# Altium project ADVPCB.PrjPcb
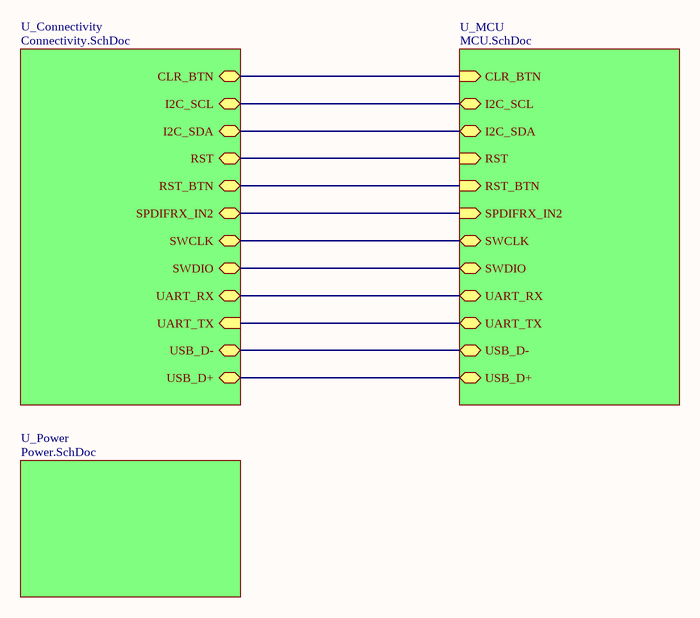
[diagram p0: Top.SchDoc]
4 sheets, 40 parts. Net scope: hierarchical (ports join the sheet entries above them; power ports are global).
Board file: Top.PcbDoc
Sheets:
  Top.SchDoc
    U_MCU = MCU.SchDoc
    U_Connectivity = Connectivity.SchDoc
    U_Power = Power.SchDoc

## Sheet Top.SchDoc
size A4; SheetNumber: 1; SheetTotal: 4

### Sub-sheets
U_Connectivity = Connectivity.SchDoc: SPDIFRX_IN2 (bidir), RST_BTN (bidir), CLR_BTN (bidir), I2C_SDA (bidir), I2C_SCL (bidir), UART_RX (bidir), UART_TX (in), RST (bidir), SWCLK (bidir), SWDIO (bidir), USB_D- (bidir), USB_D+ (bidir)
U_MCU = MCU.SchDoc: RST_BTN (in), SPDIFRX_IN2 (in), CLR_BTN (in), SWCLK (bidir), SWDIO (bidir), I2C_SCL (bidir), I2C_SDA (bidir), UART_TX (bidir), UART_RX (bidir), USB_D- (bidir), USB_D+ (bidir), RST (in)
U_Power = Power.SchDoc: no entries

### Nets
USBD_N: sheet U_MCU/USB_D-, sheet U_Connectivity/USB_D-
USBD_P: sheet U_MCU/USB_D+, sheet U_Connectivity/USB_D+
NetC12_2: sheet U_MCU/RST_BTN, sheet U_MCU/RST, sheet U_Connectivity/RST_BTN, sheet U_Connectivity/RST
NetC13_2: sheet U_MCU/CLR_BTN, sheet U_Connectivity/CLR_BTN
NetMCU_24: sheet U_MCU/SPDIFRX_IN2, sheet U_Connectivity/SPDIFRX_IN2
NetMCU_37: sheet U_MCU/UART_TX, sheet U_Connectivity/UART_TX
NetMCU_38: sheet U_MCU/UART_RX, sheet U_Connectivity/UART_RX
NetMCU_40: sheet U_MCU/I2C_SDA, sheet U_Connectivity/I2C_SDA
NetMCU_41: sheet U_MCU/I2C_SCL, sheet U_Connectivity/I2C_SCL
NetMCU_46: sheet U_MCU/SWDIO, sheet U_Connectivity/SWDIO
NetMCU_49: sheet U_MCU/SWCLK, sheet U_Connectivity/SWCLK

## Sheet MCU.SchDoc
size A4; SheetNumber: 2; SheetTotal: 4; SPICEModelCacheKZCSYQUI: <root> / <DocumentId>KZCSYQUI</DocumentId> / </root>
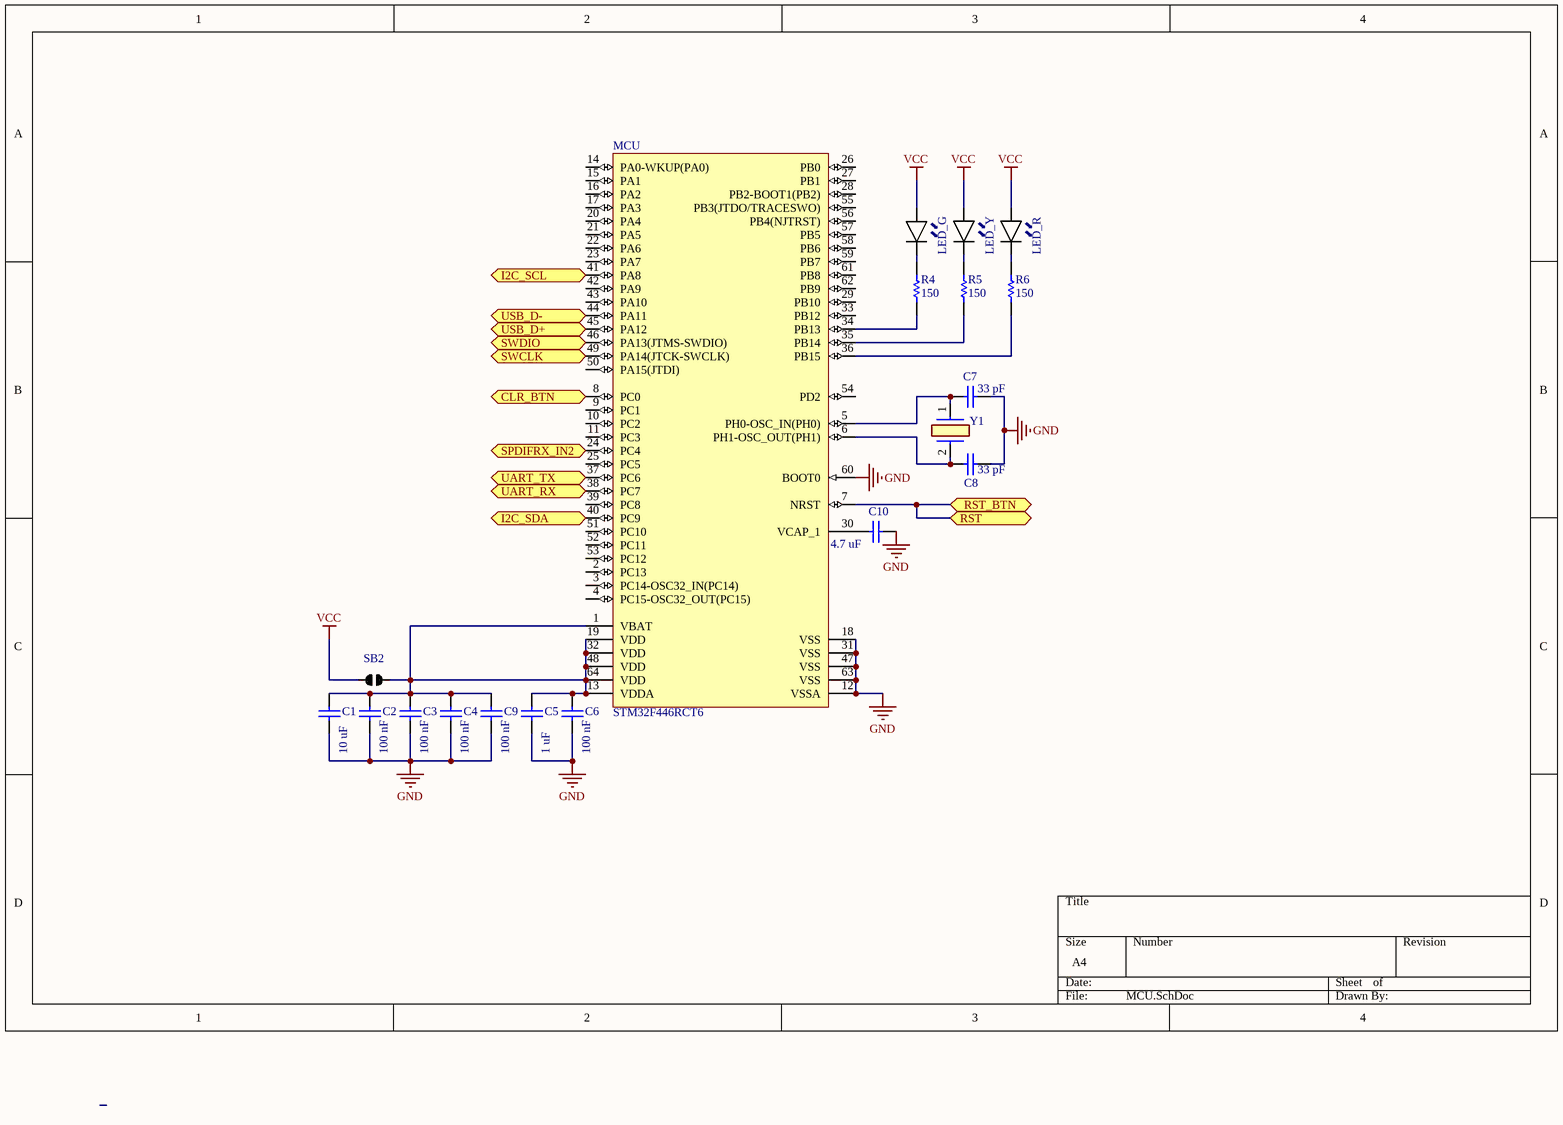
[diagram p1: MCU.SchDoc]

### Parts
C1  value 10 uF  [J1-0603]  (hidden comment: C19702)
C2  value 100 nF  [0402]  (hidden comment: C1525)
C3  value 100 nF  [0402]  (hidden comment: C1525)
C4  value 100 nF  [0402]  (hidden comment: C1525)
C5  value 1 uF  [J1-0603]  (hidden comment: C15849)
C6  value 100 nF  [0402]  (hidden comment: C1525)
C7  value 33 pF  [0402]  (hidden comment: C1562)
C8  value 33 pF  [0402]  (hidden comment: C1562)
C9  value 100 nF  [0402]  (hidden comment: C1525)
C10  value 4.7 uF  [J1-0603]  (hidden comment: C19666)
LED_G  fucking led maat hoe moeilijk ist kutprogram  [LED_SSL-LX4673GD-LA20]  (value not drawn)
LED_R  fucking led maat hoe moeilijk ist kutprogram  [LED_SSL-LX4673GD-LA20]  (value not drawn)
LED_Y  fucking led maat hoe moeilijk ist kutprogram  [LED_SSL-LX4673GD-LA20]  (value not drawn)
MCU  STM32F446RCT6  [STM-LQFP64_L]
R4  value 150  [J1-0603]  (hidden comment: C22808)
R5  value 150  [J1-0603]  (hidden comment: C22808)
R6  value 150  [J1-0603]  (hidden comment: C22808)
SB2  Solder Bridge  [Solder Bridge]  (value not drawn)
Y1  X50328MSB2GI  [RESC5032X135N]  (value not drawn)

### Ports
CLR_BTN (bidir, see Top[3A], Connectivity[3B]), I2C_SCL (bidir, see Top[3A], Connectivity[3C]), I2C_SDA (bidir, see Top[3A], Connectivity[3C]), RST (bidir, see Top[3B], Connectivity[3C]), RST_BTN (bidir, see Top[3B], Connectivity[2B]), SPDIFRX_IN2 (bidir, see Top[3B], Connectivity[3A]), SWCLK (bidir, see Top[3B], Connectivity[3C]), SWDIO (bidir, see Top[3B], Connectivity[3C]), UART_RX (bidir, see Top[3B], Connectivity[3C]), UART_TX (bidir, see Top[3B], Connectivity[3C]), USB_D+ (bidir, see Top[3B], Connectivity[2C]), USB_D- (bidir, see Top[3B], Connectivity[2C])

### Nets
GND: C1.1 C2.1 C3.1 C4.1 C5.1 C6.1 C7.2 C8.2 C9.1 C10.2 MCU.12(VSSA) MCU.18(VSS) MCU.31(VSS) MCU.47(VSS) MCU.60(BOOT0) MCU.63(VSS)
VCC: LED_G.2 LED_R.2 LED_Y.2 SB2.1
USBD_N: MCU.44(PA11) ; port USB_D-
USBD_P: MCU.45(PA12) ; port USB_D+
NetC1_2: C1.2 C2.2 C3.2 C4.2 C5.2 C6.2 C9.2 MCU.1(VBAT) MCU.13(VDDA) MCU.19(VDD) MCU.32(VDD) MCU.48(VDD) MCU.64(VDD) SB2.2
NetC7_1: C7.1 MCU.5(PH0-OSC_IN(PH0)) Y1.1
NetC8_1: C8.1 MCU.6(PH1-OSC_OUT(PH1)) Y1.2
NetC10_1: C10.1 MCU.30(VCAP_1)
NetC12_2: MCU.7(NRST) ; port RST_BTN, port RST
NetC13_2: MCU.8(PC0) ; port CLR_BTN
NetLED_G_1: LED_G.1 R4.1
NetLED_R_1: LED_R.1 R6.1
NetLED_Y_1: LED_Y.1 R5.1
NetMCU_24: MCU.24(PC4) ; port SPDIFRX_IN2
NetMCU_34: MCU.34(PB13) R4.2
NetMCU_35: MCU.35(PB14) R5.2
NetMCU_36: MCU.36(PB15) R6.2
NetMCU_37: MCU.37(PC6) ; port UART_TX
NetMCU_38: MCU.38(PC7) ; port UART_RX
NetMCU_40: MCU.40(PC9) ; port I2C_SDA
NetMCU_41: MCU.41(PA8) ; port I2C_SCL
NetMCU_46: MCU.46(PA13(JTMS-SWDIO)) ; port SWDIO
NetMCU_49: MCU.49(PA14(JTCK-SWCLK)) ; port SWCLK

Not connected (* = marked no-connect by the designer): MCU 2(PC13) 3(PC14-OSC32_IN(PC14)) 4(PC15-OSC32_OUT(PC15)) 9(PC1) 10(PC2) 11(PC3) 14(PA0-WKUP(PA0)) 15(PA1) 16(PA2) 17(PA3) 20(PA4) 21(PA5) 22(PA6) 23(PA7) 25(PC5) 26(PB0) 27(PB1) 28(PB2-BOOT1(PB2)) 29(PB10) 33(PB12) 39(PC8) 42(PA9) 43(PA10) 50(PA15(JTDI)) 51(PC10) 52(PC11) 53(PC12) 54(PD2) 55(PB3(JTDO/TRACESWO)) 56(PB4(NJTRST)) 57(PB5) 58(PB6) 59(PB7) 61(PB8) 62(PB9)

### Notes on the sheet
- (in symbol fucking led maat hoe moeilijk ist kutprogram) ⬈⬈

### Library data of the parts
C1-C10 = Cap: Capacitor; Published: 8-Jun-2000; LatestRevisionDate: 17-Jul-2002; LatestRevisionNote: Re-released for DXP Platform.; PackageReference: RAD-0.3; Publisher: Altium Limited; PackageDescription: Radial Cap, Thru-Hole; 2 Leads; 0.3 in Pin Spacing
LED_G LED_R LED_Y = fucking led maat hoe moeilijk ist kutprogram: DNP
MCU = CMP-0243-00216-1: ARM Cortex-M4 32-bit MCU+FPU, 256 KB Flash, 128 KB Internal RAM, 50 I/Os, 64-Pin LQFP, -40 to 85 degC, Tray; Operating Frequency(F) (Processor speed) (MHz): 180; Internal RAM Size (kB): 128; I/Os (High Current): 50; FLASH Size (Prog) (kB): 256; D/A Converter: 2; Supply Voltage(Vcc) min (V): 1.7; Mounting Technology: Surface Mount; DatasheetVersion: Rev. 6; ComponentLink1URL: http://www.st.com/; Package Description: LQFP64; ComponentLink1Description: Manufacturer URL; Packing: Tray; ComponentLink2Description: Datasheet; Core: ARM Cortex-M4; Package Reference: 64-Pin Low-profile Quad Flat Package, Body 10 x 10 mm, Pitch 0.5 mm; ComponentLink2URL: http://www.st.com/st-web-ui/static/active/en/resource/technical/document/datasheet/DM00141306.pdf
R4-R6 = Res1: Published: 8-Jun-2000; LatestRevisionDate: 17-Jul-2002; LatestRevisionNote: Re-released for DXP Platform.; PackageReference: AXIAL-0.3; Publisher: Altium Limited; PackageDescription: Axial Device, Thru-Hole; 2 Leads; 0.3 in Pin Spacing
SB2 = Solder Bridge: DNP
Y1 = X50328MSB2GI: C115962; Manufacturer_Name: Yangxing Tech; Datasheet Link: https://datasheet.lcsc.com/szlcsc/1903061615_Yangxing-Tech-X50328MSB2GI_C115962.pdf; Height: 1.35mm; Manufacturer_Part_Number: X50328MSB2GI

## Sheet Connectivity.SchDoc
size A4; SheetNumber: 3; SheetTotal: 4
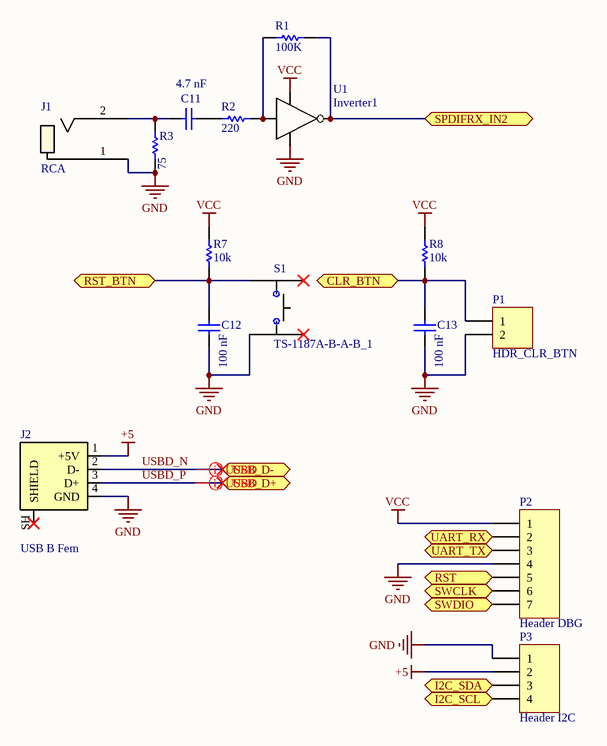
[diagram p2: Connectivity.SchDoc]

### Parts
C11  value 4.7 nF  [0402]  (hidden comment: C1538)
C12  value 100 nF  [0402]  (hidden comment: C1525)
C13  value 100 nF  [0402]  (hidden comment: C1525)
J1  RCA  [KLPX0848A2B]
J2  USB B Fem  [UJ2BH1TH]
P1  HDR_CLR_BTN  [HDR1X2]
P2  Header DBG  [HDR1X7]
P3  Header I2C  [HDR1X4]
R1  value 100K  [J1-0603]  (hidden comment: C25803)
R2  value 220  [J1-0603]  (hidden comment: C22962)
R3  value 75  [J1-0603]  (hidden comment: C4275)
R7  value 10k  [J1-0603]  (hidden comment: C25804)
R8  value 10k  [J1-0603]  (hidden comment: C25804)
S1  TS-1187A-B-A-B_1  [TS1187ABAB]
U1  Inverter1  [DBV5-M]

### Ports
CLR_BTN (bidir, see Top[2A], MCU[2B]), I2C_SCL (bidir, see Top[2A], MCU[2B]), I2C_SDA (bidir, see Top[2A], MCU[2C]), RST (bidir, see Top[2B], MCU[3C]), RST_BTN (bidir, see Top[2B], MCU[3B]), SPDIFRX_IN2 (bidir, see Top[2B], MCU[2B]), SWCLK (bidir, see Top[2B], MCU[2B]), SWDIO (bidir, see Top[2B], MCU[2B]), UART_RX (bidir, see Top[2B], MCU[2B]), UART_TX (bidir, see Top[2B], MCU[2B]), USB_D+ (bidir, see Top[2B], MCU[2B]), USB_D- (bidir, see Top[2B], MCU[2B])

### Nets
+5: J2.1(+5V) P3.2
GND: C12.1 C13.1 J1.1 J2.4(GND) P1.2 P2.4 P3.1 R3.1 S1.C1(NO_1) U1.3(GND)
VCC: P2.1 R7.1 R8.1 U1.5(VCC)
USBD_N: J2.2(D-) ; port USB_D-
USBD_P: J2.3(D+) ; port USB_D+
NetC11_1: C11.1 J1.2 R3.2
NetC11_2: C11.2 R2.2
NetC12_2: C12.2 P2.5 R7.2 S1.A1(COM_1) ; port RST_BTN, port RST
NetC13_2: C13.2 P1.1 R8.2 ; port CLR_BTN
NetMCU_24: R1.1 U1.4(Y) ; port SPDIFRX_IN2
NetMCU_37: P2.3 ; port UART_TX
NetMCU_38: P2.2 ; port UART_RX
NetMCU_40: P3.3 ; port I2C_SDA
NetMCU_41: P3.4 ; port I2C_SCL
NetMCU_46: P2.7 ; port SWDIO
NetMCU_49: P2.6 ; port SWCLK
NetR1_2: R1.2 R2.1 U1.2(A)

Not connected (* = marked no-connect by the designer): J2 SH(SHIELD)*; S1 B1(COM_2)* D1(NO_2)*

### Layout directives
differential pair: USBD_N, USBD_P

### Library data of the parts
C11-C13 = Cap: Capacitor; Published: 8-Jun-2000; LatestRevisionDate: 17-Jul-2002; LatestRevisionNote: Re-released for DXP Platform.; PackageReference: RAD-0.3; Publisher: Altium Limited; PackageDescription: Radial Cap, Thru-Hole; 2 Leads; 0.3 in Pin Spacing
J1 = KLPX-0848A-2-B: DNP; Mfr_Name: KYCON, INC.; Copyright: Copyright (C) 2023 Ultra Librarian. All rights reserved.; Manufacturer_Part_Number: KLPX-0848A-2-B; RefDes: RefDes; Type: DEV
J2 = USB B Fem: DNP; pin to pad: SH>MH
P1 = Header 2: Header, 2-Pin DNP; LatestRevisionDate: 17-Jul-2002; LatestRevisionNote: Re-released for DXP Platform.; Publisher: Altium Limited
P2 = Header 7: C492406; LatestRevisionDate: 17-Jul-2002; LatestRevisionNote: Re-released for DXP Platform.; Publisher: Altium Limited
P3 = Header 4: C6332197; LatestRevisionDate: 17-Jul-2002; LatestRevisionNote: Re-released for DXP Platform.; Publisher: Altium Limited
R1-R3 R7 R8 = Res1: Published: 8-Jun-2000; LatestRevisionDate: 17-Jul-2002; LatestRevisionNote: Re-released for DXP Platform.; PackageReference: AXIAL-0.3; Publisher: Altium Limited; PackageDescription: Axial Device, Thru-Hole; 2 Leads; 0.3 in Pin Spacing
S1 = TS-1187A-B-A-B_1: C318884; Manufacturer_Name: XKB Connectivity; Datasheet Link: http://www.helloxkb.com/public/images/pdf/TS-1187A-X-X-X.pdf; Height: 4.05mm; Manufacturer_Part_Number: TS-1187A-B-A-B
U1 = Inverter1: C81934; Supplier 1: Digi-Key; Supplier Part Number 1: 296-8487-1-ND

## Sheet Power.SchDoc
size A4; SheetNumber: 4; SheetTotal: 4
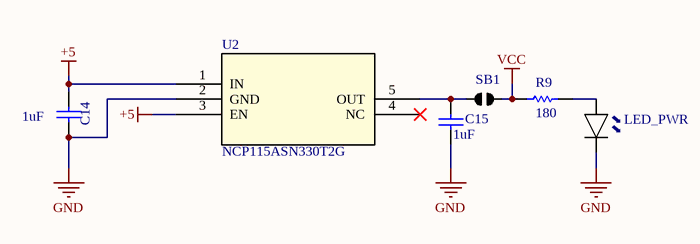
[diagram p3: Power.SchDoc]

### Parts
C14  value 1uF  [J1-0603]  (hidden comment: C15849)
C15  value 1uF  [J1-0603]  (hidden comment: C15849)
LED_PWR  C2286  [LEDC1608X70N]  (value not drawn)
R9  value 180  [J1-0603]  (hidden comment: C22828)
SB1  Solder Bridge  [Solder Bridge]  (value not drawn)
U2  NCP115ASN330T2G  [SOT95P275X120-5N]

### Nets
+5: C14.2 U2.1(IN) U2.3(EN)
GND: C14.1 C15.1 LED_PWR.1 U2.2(GND)
VCC: R9.1 SB1.2
NetC15_2: C15.2 SB1.1 U2.5(OUT)
NetLED_PWR_2: LED_PWR.2 R9.2

Not connected (* = marked no-connect by the designer): U2 4(NC)*

### Notes on the sheet
- (in symbol fucking led maat hoe moeilijk ist kutprogram) ⬈⬈

### Library data of the parts
C14 C15 = Cap: Capacitor; Published: 8-Jun-2000; LatestRevisionDate: 17-Jul-2002; LatestRevisionNote: Re-released for DXP Platform.; PackageReference: RAD-0.3; Publisher: Altium Limited; PackageDescription: Radial Cap, Thru-Hole; 2 Leads; 0.3 in Pin Spacing
LED_PWR = fucking led maat hoe moeilijk ist kutprogram
R9 = Res1: Published: 8-Jun-2000; LatestRevisionDate: 17-Jul-2002; LatestRevisionNote: Re-released for DXP Platform.; PackageReference: AXIAL-0.3; Publisher: Altium Limited; PackageDescription: Axial Device, Thru-Hole; 2 Leads; 0.3 in Pin Spacing
SB1 = Solder Bridge: DNP
U2 = NCP115ASN330T2G: C603505; Mfr_Name: onsemi; Copyright: Copyright (C) 2023 Ultra Librarian. All rights reserved.; Manufacturer_Part_Number: NCP115ASN330T2G; RefDes: RefDes; Type: DEV

## Nets that join several sheets
+5: Connectivity (J2.1 P3.2), Power (C14.2 U2.1 U2.3)
GND: MCU (16 pins), Connectivity (10 pins), Power (C14.1 C15.1 LED_PWR.1 U2.2)
VCC: MCU (LED_G.2 LED_R.2 LED_Y.2 SB2.1), Connectivity (P2.1 R7.1 R8.1 U1.5), Power (R9.1 SB1.2)
NetC12_2: MCU (MCU.7), Connectivity (C12.2 P2.5 R7.2 S1.A1)
NetC13_2: MCU (MCU.8), Connectivity (C13.2 P1.1 R8.2)
NetMCU_24: MCU (MCU.24), Connectivity (R1.1 U1.4)
NetMCU_37: MCU (MCU.37), Connectivity (P2.3)
NetMCU_38: MCU (MCU.38), Connectivity (P2.2)
NetMCU_40: MCU (MCU.40), Connectivity (P3.3)
NetMCU_41: MCU (MCU.41), Connectivity (P3.4)
NetMCU_46: MCU (MCU.46), Connectivity (P2.7)
NetMCU_49: MCU (MCU.49), Connectivity (P2.6)
USBD_N: MCU (MCU.44), Connectivity (J2.2)
USBD_P: MCU (MCU.45), Connectivity (J2.3)